# Altium project Altium-Alarm_Timer.PrjPCB
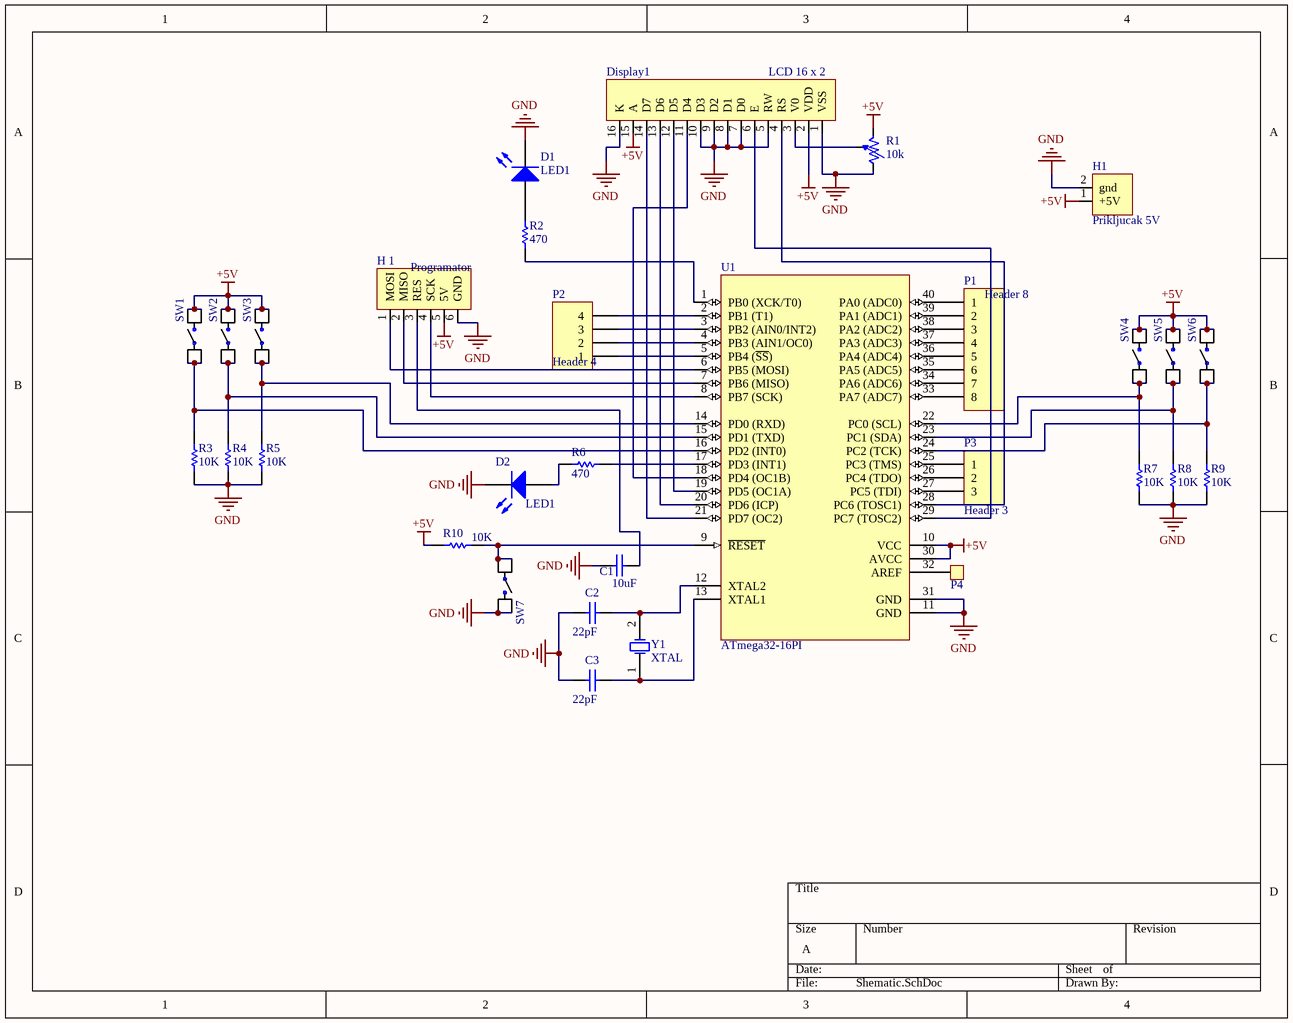
[diagram p0: Shematic.SchDoc]
1 sheet, 31 parts. Net scope: global (net labels, ports and power ports of the same name join across sheets).
Board file: PCB.PcbDoc

## Sheet Shematic.SchDoc
size A

### Parts
C1  value 10uF  [RAD-0.3]  (hidden comment: Cap)
C2  value 22pF  [RAD-0.3]  (hidden comment: Cap)
C3  value 22pF  [RAD-0.3]  (hidden comment: Cap)
D1  LED1  [LED-1]
D2  LED1  [LED-1]
Display1  LCD 16 x 2  [LCD16x2]
H1  Prikljucak 5V  [H 5V]
H_1  Programator  [USBASP]
P1  Header 8  [HDR1X8]
P2  Header 4  [HDR1X4]
P3  Header 3  [HDR1X3]
P4  Header 1  [Header 1]  (value not drawn)
R1  10k  [ADJ_RES]
R2  value 470  [AXIAL-0.3]  (hidden comment: Res1)
R3  value 10K  [AXIAL-0.3]  (hidden comment: Res1)
R4  value 10K  [AXIAL-0.3]  (hidden comment: Res1)
R5  value 10K  [AXIAL-0.3]  (hidden comment: Res1)
R6  value 470  [AXIAL-0.3]  (hidden comment: Res1)
R7  value 10K  [AXIAL-0.3]  (hidden comment: Res1)
R8  value 10K  [AXIAL-0.3]  (hidden comment: Res1)
R9  value 10K  [AXIAL-0.3]  (hidden comment: Res1)
R10  value 10K  [AXIAL-0.3]  (hidden comment: Res1)
SW1  2-1437565-8  [*SW_SMD_2-1437565-8_4_4.50_6.00_6.00_5.00]  (value not drawn)
SW2  2-1437565-8  [*SW_SMD_2-1437565-8_4_4.50_6.00_6.00_5.00]  (value not drawn)
SW3  2-1437565-8  [*SW_SMD_2-1437565-8_4_4.50_6.00_6.00_5.00]  (value not drawn)
SW4  2-1437565-8  [*SW_SMD_2-1437565-8_4_4.50_6.00_6.00_5.00]  (value not drawn)
SW5  2-1437565-8  [*SW_SMD_2-1437565-8_4_4.50_6.00_6.00_5.00]  (value not drawn)
SW6  2-1437565-8  [*SW_SMD_2-1437565-8_4_4.50_6.00_6.00_5.00]  (value not drawn)
SW7  2-1437565-8  [*SW_SMD_2-1437565-8_4_4.50_6.00_6.00_5.00]  (value not drawn)
U1  ATmega32-16PI  [40P6]
Y1  XTAL  [R38]

### Nets
+5V: Display1.2(VDD) Display1.15(A) H1.1(+5V) H_1.5(5V) R1.2 R10.1 SW1.3 SW1.4 SW2.3 SW2.4 SW3.3 SW3.4 SW4.3 SW4.4 SW5.3 SW5.4 SW6.3 SW6.4 U1.10(VCC) U1.30(AVCC)
GND: C1.2 C2.1 C3.1 D1.2(K) D2.2(K) Display1.1(VSS) Display1.5(RW) Display1.7(D0) Display1.8(D1) Display1.9(D2) Display1.10(D3) Display1.16(K) H1.2(gnd) H_1.6(GND) R1.1 R3.1 R4.1 R5.1 R7.1 R8.1 R9.1 SW7.3 SW7.4 U1.11(GND) U1.31(GND)
NetC1_1: C1.1 H_1.3(RES)
NetC2_2: C2.2 U1.12(XTAL2) Y1.2(OSC2)
NetC3_2: C3.2 U1.13(XTAL1) Y1.1(OSC1)
NetD1_1: D1.1(A) R2.1
NetD2_1: D2.1(A) R6.2
NetDisplay1_3: Display1.3(V0) R1.3
NetDisplay1_4: Display1.4(RS) U1.28(PC6_(TOSC1))
NetDisplay1_6: Display1.6(E) U1.29(PC7_(TOSC2))
NetDisplay1_11: Display1.11(D4) U1.18(PD4_(OC1B))
NetDisplay1_12: Display1.12(D5) U1.19(PD5_(OC1A))
NetDisplay1_13: Display1.13(D6) U1.20(PD6_(ICP))
NetDisplay1_14: Display1.14(D7) U1.21(PD7_(OC2))
NetH_1_1: H_1.1(MOSI) U1.6(PB5_(MOSI))
NetH_1_2: H_1.2(MISO) U1.7(PB6_(MISO))
NetH_1_4: H_1.4(SCK) U1.8(PB7_(SCK))
NetP1_1: P1.1 U1.40(PA0_(ADC0))
NetP1_2: P1.2 U1.39(PA1_(ADC1))
NetP1_3: P1.3 U1.38(PA2_(ADC2))
NetP1_4: P1.4 U1.37(PA3_(ADC3))
NetP1_5: P1.5 U1.36(PA4_(ADC4))
NetP1_6: P1.6 U1.35(PA5_(ADC5))
NetP1_7: P1.7 U1.34(PA6_(ADC6))
NetP1_8: P1.8 U1.33(PA7_(ADC7))
NetP2_1: P2.1 U1.5(PB4_(~{SS}))
NetP2_2: P2.2 U1.4(PB3_(AIN1/OC0))
NetP2_3: P2.3 U1.3(PB2_(AIN0/INT2))
NetP2_4: P2.4 U1.2(PB1_(T1))
NetP3_1: P3.1 U1.25(PC3_(TMS))
NetP3_2: P3.2 U1.26(PC4_(TDO))
NetP3_3: P3.3 U1.27(PC5_(TDI))
NetP4_1: P4.1 U1.32(AREF)
NetR2_2: R2.2 U1.1(PB0_(XCK/T0))
NetR3_2: R3.2 SW1.1 SW1.2 U1.16(PD2_(INT0))
NetR4_2: R4.2 SW2.1 SW2.2 U1.15(PD1_(TXD))
NetR5_2: R5.2 SW3.1 SW3.2 U1.14(PD0_(RXD))
NetR6_1: R6.1 U1.17(PD3_(INT1))
NetR7_2: R7.2 SW4.1 SW4.2 U1.22(PC0_(SCL))
NetR8_2: R8.2 SW5.1 SW5.2 U1.23(PC1_(SDA))
NetR9_2: R9.2 SW6.1 SW6.2 U1.24(PC2_(TCK))
NetR10_2: R10.2 SW7.1 SW7.2 U1.9(~{RESET})

### Library data of the parts
C1-C3 = Cap: Capacitor; Published: 8-Jun-2000; LatestRevisionDate: 17-Jul-2002; LatestRevisionNote: Re-released for DXP Platform.; PackageReference: RAD-0.3; Publisher: Altium Limited; PackageDescription: Radial Cap, Thru-Hole; 2 Leads; 0.3 in Pin Spacing
D1 D2 = LED1: Typical RED GaAs LED; Published: 8-Jun-2000; LatestRevisionDate: 08-Jul-2005; LatestRevisionNote: Mech Layer 1 removed.; PackageReference: LED-1; Publisher: Altium Limited; PackageDescription: LED; 2 Leads
H1 = Header 5V
H_1 = USBASP
P1 = Header 8: Header, 8-Pin; LatestRevisionDate: 17-Jul-2002; LatestRevisionNote: Re-released for DXP Platform.; Publisher: Altium Limited
P2 = Header 4: Header, 4-Pin; LatestRevisionDate: 17-Jul-2002; LatestRevisionNote: Re-released for DXP Platform.; Publisher: Altium Limited
P3 = Header 3: Header, 3-Pin; LatestRevisionDate: 17-Jul-2002; LatestRevisionNote: Re-released for DXP Platform.; Publisher: Altium Limited
R1 = ADJ_RES
R2-R10 = Res1: Resistor; Published: 8-Jun-2000; LatestRevisionDate: 17-Jul-2002; LatestRevisionNote: Re-released for DXP Platform.; PackageReference: AXIAL-0.3; Publisher: Altium Limited; PackageDescription: Axial Device, Thru-Hole; 2 Leads; 0.3 in Pin Spacing
SW1-SW7 = 2-1437565-8: Tactile Switch SPST-NO Top Actuated Surface Mount; Configuration_Pole-Throw: Single Pole - Single Throw; MF: TE Connectivity; Contact_Current_Rating: 50 mA; Package: None; TE_purchase_URL: https://www.te.com/usa-en/product-2-1437565-8.html?te_bu=Cor&te_type=disp&te_campaign=seda_glo_cor-seda-global-disp-prtnr-fy19-seda-model-bom-cta_sma-317_1&elqCampaignId=32493; MP: 2-1437565-8; Price: None; SnapEDA_Link: https://www.snapeda.com/parts/2-1437565-8/TE%20Connectivity%20ALCOSWITCH%20Switches/view-part/455292/?ref=snap; Availability: Unavailable; Value: *
U1 = ATmega32-16PI: 8-Bit AVR Microcontroller with 32K Bytes of In-System Programmable Flash Memory; Published: 17-Sep-2003; DatasheetVersion: 2503C-AVR-10/02; PackageVersion: revB, Sep-2001; PackageReference: 40P6; Publisher: Altium Limited; PackageDescription: 40-lead (0.600"/15.24mm Wide) Plastic Dual Inline Package (PDIP); Supplier 1: Digi-Key; Supplier Part Number 1: ATMEGA32-16PI-ND; Supplier 2: Farnell; Supplier Part Number 2: 4376328; Supplier 3: Mouser; Supplier Part Number 3: 556-ATMEGA32-16PI; Code_JEDEC: MS-011-AC; ComponentLink1Description: Datasheet; ComponentLink1URL: http://www.atmel.com/dyn/resources/prod_documents/doc2503.pdf; ComponentLink2Description: Atmel.com Home; ComponentLink2URL: http://www.atmel.com
Y1 = XTAL: Crystal Oscillator; Published: 8-Jun-2000; LatestRevisionDate: 17-Jul-2002; LatestRevisionNote: Re-released for DXP Platform.; PackageReference: R38; Publisher: Altium Limited; PackageDescription: Crystal, Thru-Hole; 2 Leads; Body 3.1 x 8.2 mm (Dia.xH)